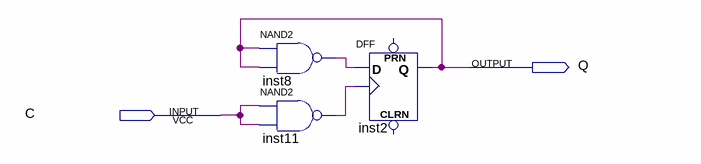
[diagram p0: schematic sheet]
// Quartus schematic my_dff.bdf as structural Verilog: 3 symbols, 2 pins
module my_dff (
  input  C,
  output Q
);

  wire inst8_out, inst11_out;

  nand inst8 (inst8_out, Q, Q);
  nand inst11 (inst11_out, C, C);
  DFF inst2 (.CLK(inst11_out), .D(inst8_out), .Q(Q));  // open: CLRN, PRN
endmodule
